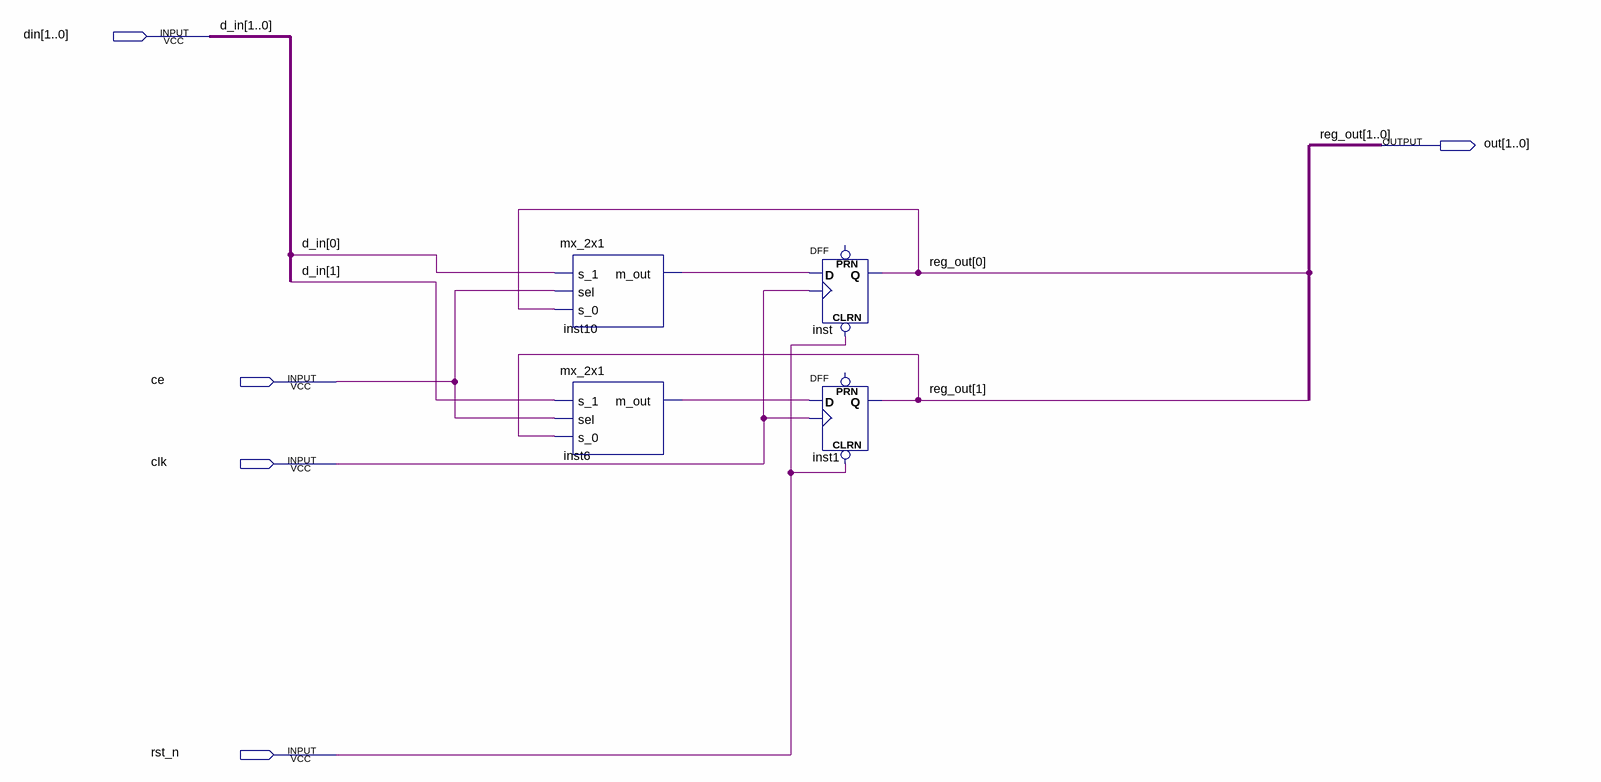
[diagram p0: schematic sheet]
// Quartus schematic two_bit_reg_ce.bdf as structural Verilog: 4 symbols, 5 pins
module two_bit_reg_ce (
  input  [1:0] din,
  input  ce,
  input  clk,
  input  rst_n,
  output [1:0] out
);

  wire inst6_m_out, inst10_m_out;

  mx_2x1 inst10 (.s_1(din[0]), .sel(ce), .s_0(out[0]), .m_out(inst10_m_out));
  mx_2x1 inst6 (.s_1(din[1]), .sel(ce), .s_0(out[1]), .m_out(inst6_m_out));
  DFF inst (.CLRN(rst_n), .CLK(clk), .D(inst10_m_out), .Q(out[0]));  // open: PRN
  DFF inst1 (.CLRN(rst_n), .CLK(clk), .D(inst6_m_out), .Q(out[1]));  // open: PRN

  // Other names for the same wires on the sheet: d_in[1:0] = din; reg_out[1:0] = out
endmodule
